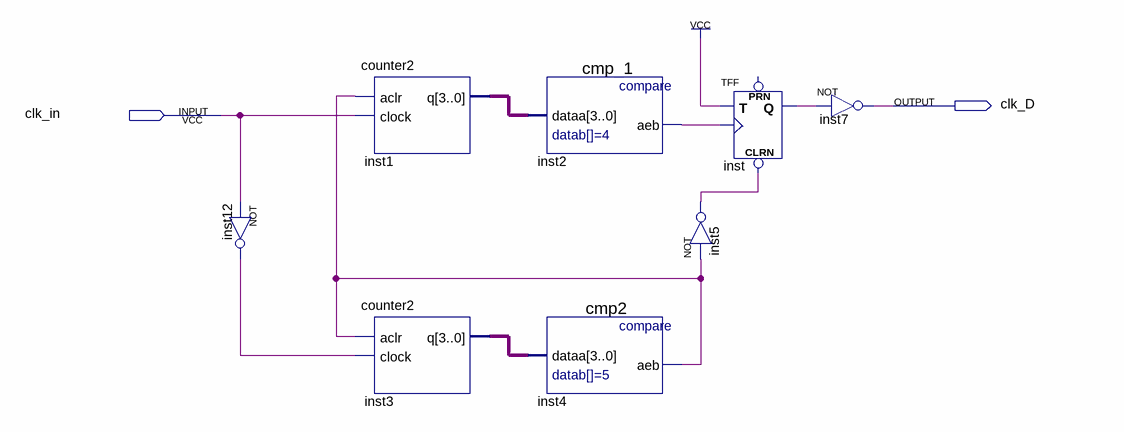
[diagram p0: schematic sheet]
// Quartus schematic Block2.bdf as structural Verilog: 8 symbols, 2 pins
module Block2 (
  input  clk_in,
  output clk_D
);

  wire inst2_aeb, inst4_aeb, inst5_out, inst12_out, inst_q;
  wire [3:0] inst1_q, inst3_q;

  not inst12 (inst12_out, clk_in);
  counter2 inst1 (.aclr(inst4_aeb), .clock(clk_in), .q(inst1_q));
  counter2 inst3 (.aclr(inst4_aeb), .clock(inst12_out), .q(inst3_q));
  cmp_1 inst2 (.dataa(inst1_q), .aeb(inst2_aeb));
  cmp2 inst4 (.dataa(inst3_q), .aeb(inst4_aeb));
  not inst5 (inst5_out, inst4_aeb);
  TFF inst (.CLRN(inst5_out), .T(1'b1), .CLK(inst2_aeb), .Q(inst_q));  // open: PRN
  not inst7 (clk_D, inst_q);
endmodule
